# EAGLE design Circuit Diagram (EAGLE 9.3.0)
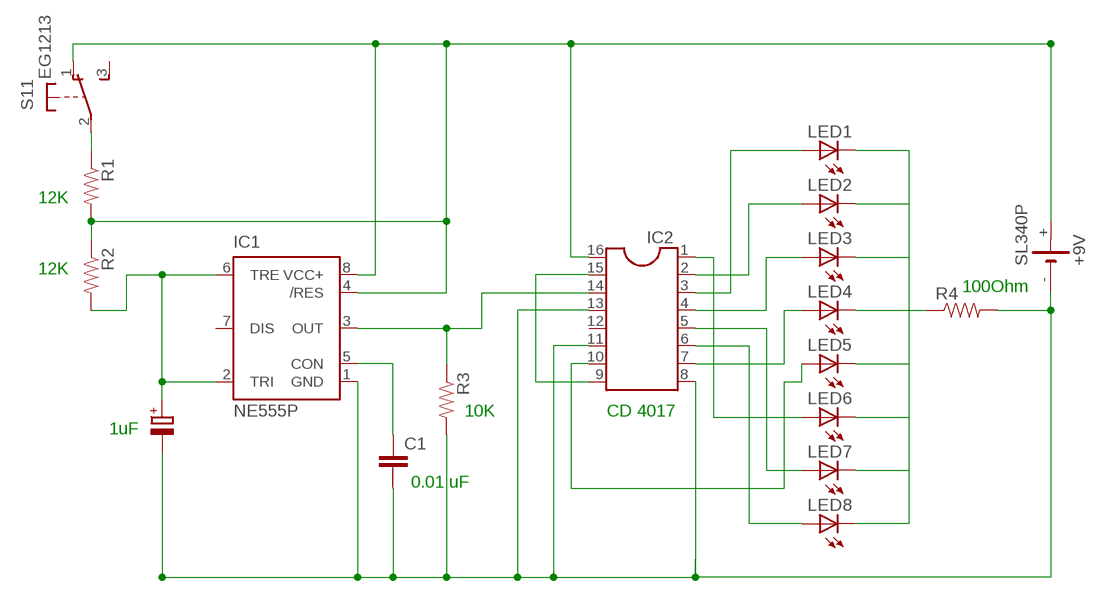
[diagram p0: schematic, sheet 1]

## Parts
+9V  SL340P  [SL-340/P3.6V]
C1  C2.5/6  [C2.5-6]
IC1  NE555P  [DIL-08]
IC2  DIL16  [DIL16]
LED1  LEDB156  [Q62902-B156]
LED2  LEDB156  [Q62902-B156]
LED3  LEDB156  [Q62902-B156]
LED4  LEDB156  [Q62902-B156]
LED5  LEDB156  [Q62902-B156]
LED6  LEDB156  [Q62902-B156]
LED7  LEDB156  [Q62902-B156]
LED8  LEDB156  [Q62902-B156]
R1  RESISTORAXIAL-0.3  [AXIAL-0.3]
R2  RESISTORAXIAL-0.3  [AXIAL-0.3]
R3  RESISTORAXIAL-0.3  [AXIAL-0.3]
R4  RESISTORAXIAL-0.3  [AXIAL-0.3]
S1  EG1213  [EG1213]

## Nets
N$1: IC2.3 LED1.A
N$2: IC2.2 LED2.A
N$3: IC2.4 LED3.A
N$4: IC2.7 LED4.A
N$5: IC2.10 LED5.A
N$6: IC2.1 LED6.A
N$7: IC2.5 LED7.A
N$8: IC2.9 IC2.15
N$9: +9V.- C1.2 IC1.1(GND) IC2.8 IC2.11 IC2.13 R3.P$2 R4.P$2
N$10: IC2.6 LED8.A
N$11: R1.P$1 S1.2(1:P)
N$13: LED1.K(C) LED2.K(C) LED3.K(C) LED4.K(C) LED5.K(C) LED6.K(C) LED7.K(C) LED8.K(C) R4.P$1
N$14: IC1.3(OUT) IC2.14 R3.P$1
N$18: +9V.+ IC1.4(/RES) IC1.8(VCC+) IC2.16 R1.P$2 R2.P$1 S1.1(1:O)
N$19: IC1.2(TRI) IC1.6(TRE) R2.P$2
N$21: C1.1 IC1.5(CON)
Unconnected: IC1.7(DIS) IC2.12 S1.3(1:S) S1.MT1(MT) S1.MT2(MT)

## Notes on the sheet
- 12K
- 12K
- 100Ohm
- 10K | CD 4017
- 1uF
- 0.01 uF

## Library data of the parts
+9V = battery:SL340P: LI BATTERY Sonnenschein SL-340 P 3.6 V
C1 = capacitor-wima:C: CAPACITOR naming: grid - package width
IC1 = SparkFun-AnalogIC:NE555: General purpose bipolar Timer; MF: Arrow Electronics; MPN: NE555N; OC_FARNELL: 1467742; OC_NEWARK: 89K1486
IC2 = ic-package:DIL16: Dual In Line / Socket
LED1-LED8 = led:LED: LED OSRAM: - CHIPLED LG R971, LG N971, LY N971, LG Q971, LY Q971, LO R971, LY R971 LH N974, LH R974 LS Q976, LO Q976, LY Q976 LO Q996 - Hyper CHIPLED LW Q18S LB Q993, LB Q99A, LB R99A - SideLED LS A670, LO A670, LY A670, LG A670, LP A670 LB A673, LV A673, LT A673, LW A673 LH A674 LY A675 LS A676, LA A676, LO A676, LY A676, LW A676 LS A679, LY A679, LG A679 - Hyper Micro SIDELED® LS Y876, LA Y876, LO Y876, LY Y876 LT Y87S - SmartLED LW L88C, LW L88S LB L89C, LB L89S, LG L890 LS L89K, LO L89K, LY L89K LS L896, LA L896, LO L896, LY L896 - TOPLED LS T670, LO T670, LY T670, LG T670, LP T670 LSG T670, LSP T670, LSY T670, LOP T670, LYG T670 LG T671, LOG T671, LSG T671 LB T673, LV T673, LT T673, LW T673 LH T674 LS T676, LA T676, LO T676, LY T676, LB T676, LH T676, LSB T676, LW T676 LB T67C, LV T67C, LT T67C, LS T67K, LO T67K, LY T67K, LW E67C LS E67B, LA E67B, LO E67B, LY E67B, LB E67C, LV E67C, LT E67C LW T67C LS T679, LY T679, LG T679 LS T770, LO T770, LY T770, LG T770, LP T770 LB T773, LV T773, LT T773, LW T773 LH T774 LS E675, LA E675, LY E675, LS T675 LS T776, LA T776, LO T776, LY T776, LB T776 LHGB T686 LT T68C, LB T68C - Hyper Mini TOPLED® LB M676 - Mini TOPLED Santana® LG M470 LS M47K, LO M47K, LY M47K Source: http://www.osram.convergy.de LUXEON: - LUMILED® LXK2-PW12-R00, LXK2-PW12-S00, LXK2-PW14-U00, LXK2-PW14-V00 LXK2-PM12-R00, LXK2-PM12-S00, LXK2-PM14-U00 LXK2-PE12-Q00, LXK2-PE12-R00, LXK2-PE12-S00, LXK2-PE14-T00, LXK2-PE14-U00 LXK2-PB12-K00, LXK2-PB12-L00, LXK2-PB12-M00, LXK2-PB14-N00, LXK2-PB14-P00, LXK2-PB14-Q00 LXK2-PR12-L00, LXK2-PR12-M00, LXK2-PR14-Q00, LXK2-PR14-R00 LXK2-PD12-Q00, LXK2-PD12-R00, LXK2-PD12-S00 LXK2-PH12-R00, LXK2-PH12-S00 LXK2-PL12-P00, LXK2-PL12-Q00, LXK2-PL12-R00 Source: www.luxeon.com KINGBRIGHT: KA-3528ASYC Source: www.kingbright.com
R1-R4 = SparkFun-Passives:RESISTOR: Resistor Basic schematic elements and footprints for 0603, 1206, and PTH resistors.
S1 = adafruit:EG1213: E-Switch right-angle slide SPDT Part #EG1213 http://www.ladyada.net/library/eagle

## Board
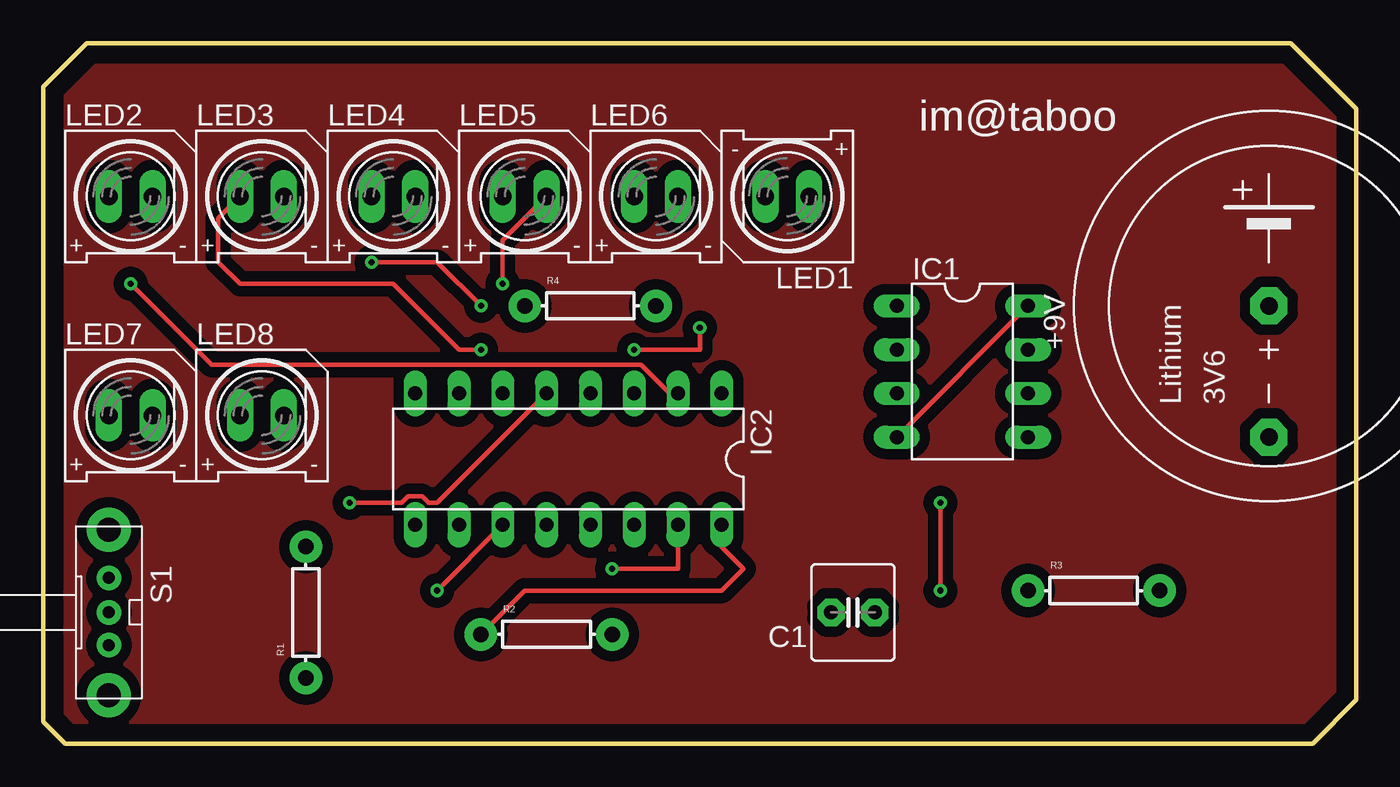
[diagram p1: board, top side]
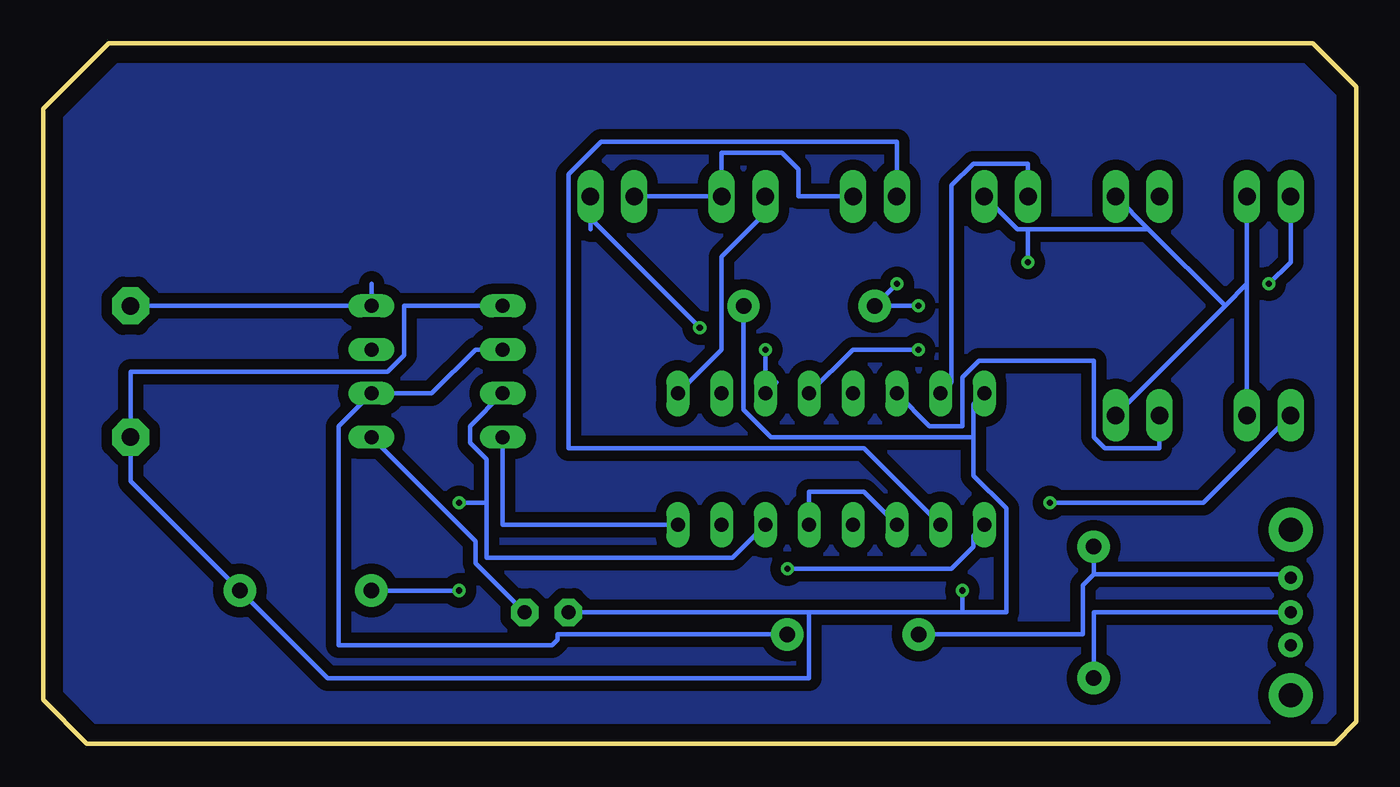
[diagram p2: board, bottom side, seen from below]

Size 76.2 x 40.64 mm. Coordinates in mm from the lower left corner, seen from the top.
Outline: 0,38.1 0,1.27 1.27,0 73.66,0 76.2,2.54 76.2,36.83 72.39,40.64 2.54,40.64 0,38.1
Copper layers (1*16): Top 0.035mm / dielectric 1.5mm / Bottom 0.035mm
Design rules "default *": minimum track width 10mil, minimum drill 0.35mm, track to track 10mil, track to pad 8mil, pad to pad 8mil, via to via 6mil, smd to smd 6mil, copper to edge 40mil, drill to drill 6mil, minimum pad ring 10mil, minimum via ring 8mil, stop-mask expansion 4mil, vias tented up to drill 0mil, thermal gap 10mil

### Footprints (pad centres in the part's own frame; a part is rotated, then mirrored left to right if it is on the bottom)
SL-340/P3.6V = drill 1.016 pad 2.159 octagon: + 0,0; - -7.62,0
C2.5-6 = drill 0.813 pad 1.6 octagon: 1 -1.27,0; 2 1.27,0
DIL-08 = drill 0.813 long: 1 -3.81,-3.81; 2 -1.27,-3.81; 3 1.27,-3.81; 4 3.81,-3.81; 5 3.81,3.81; 6 1.27,3.81; 7 -1.27,3.81; 8 -3.81,3.81
DIL16 = drill 0.813 long: 1 -8.89,-3.81; 2 -6.35,-3.81; 3 -3.81,-3.81; 4 -1.27,-3.81; 5 1.27,-3.81; 6 3.81,-3.81; 7 6.35,-3.81; 8 8.89,-3.81; 9 8.89,3.81; 10 6.35,3.81; 11 3.81,3.81; 12 1.27,3.81; 13 -1.27,3.81; 14 -3.81,3.81; 15 -6.35,3.81; 16 -8.89,3.81
Q62902-B156 = drill 1.016 long: A -1.27,0; K 1.27,0
AXIAL-0.3 = drill 0.9 pad 1.88: P$1 -3.81,0; P$2 3.81,0
EG1213 = drill 0.7 pad 1.422: 1 -2,0; 2 0,0; 3 1.9,0 | drill 1.4 pad 2.54: MT1 -4.8,0; MT2 4.8,0

### Placement (x,y rotation side)
+9V  71.12,25.4 90 top
C1  46.99,7.62 180 top
IC1  53.34,21.59 270 top
IC2  30.48,16.51 180 top
LED1  43.18,31.75 180 top
LED2  5.08,31.75 0 top
LED3  12.7,31.75 0 top
LED4  20.32,31.75 0 top
LED5  27.94,31.75 0 top
LED6  35.56,31.75 0 top
LED7  5.08,19.05 0 top
LED8  12.7,19.05 0 top
R1  15.24,7.62 90 top
R2  29.21,6.35 0 top
R3  60.96,8.89 0 top
R4  31.75,25.4 0 top
S1  3.81,7.62 270 top

### Tracks (layer width: path | path; a pad name or v marks a point on that pad's centre or on a via)
GND
  pour Bottom (isolate 0.61): 2.54,40.64 0,38.1 0,1.27 1.27,0 73.66,0 76.2,2.54 76.2,36.83 72.39,40.64
  pour Top (isolate 0.61): 2.54,39.37 1.27,38.1 1.27,1.27 73.66,1.27 74.93,2.54 74.93,3.81 74.93,35.56 74.93,36.83 72.39,39.37
N$1  (via drill 0.35)
  Top 0.254: v38.1,24.13 38.1,22.86 v34.29,22.86
  Bottom 0.254: 33.66,20.96 IC2.3 v34.29,22.86 | LED1.A 44.45,30.48 | 44.45,30.48 44.45,29.85 | 44.45,30.48 v38.1,24.13
N$2  (via drill 0.35)
  Top 0.254: IC2.2 36.35,20.32 34.7,21.97 9.78,21.97 v5.08,26.67
  Bottom 0.254: LED2.A 3.81,27.94 v5.08,26.67
N$3  (via drill 0.35)
  Top 0.254: v25.4,22.86 24.13,22.86 20.32,26.67 11.43,26.67 10.16,27.94 10.16,30.48 LED3.A
  Bottom 0.254: IC2.4 29.21,22.86 v25.4,22.86
  other vias: 11.43,31.75
N$4
  Bottom 0.254: IC2.7 23.5,20.96 23.5,32.38 22.22,33.65 19.05,33.65 LED4.A
N$5
  Bottom 0.254: IC2.10 28.57,17.15 45.72,17.15 45.72,33.02 43.82,34.93 26.67,34.93 LED5.A
N$6
  Bottom 0.254: IC2.1 36.83,22.86 36.83,28.26 34.29,30.8 LED6.A
N$7  (via drill 0.35)
  Top 0.254: IC2.5 22.86,13.97 22.38,13.97 22,14.35 21.18,14.35 20.8,13.97 v17.78,13.97
  Bottom 0.254: LED7.A 8.89,13.97 v17.78,13.97
N$8  (via drill 0.35)
  Top 0.254: v33.02,10.16 36.83,10.16 IC2.15
  Bottom 0.254: IC2.9 22.22,12.06 22.22,11.43 23.5,10.16 v33.02,10.16
N$9  (via drill 0.35)
  Top 0.254: IC2.11 v22.86,8.89
  Bottom 0.254: IC1.1 55.25,25.4 55.25,22.54 56.2,21.59 71.12,21.59 +9V.- 71.12,15.24 R3.P$2 59.69,3.81 31.75,3.81 31.75,7.62 | IC2.11 28.57,14.6 31.75,14.6 IC2.13 | IC2.8 22.22,19.69 22.22,17.78 | 22.22,17.78 22.22,15.56 20.32,13.65 20.32,7.62 22.86,7.62 | 22.86,7.62 31.75,7.62 | 31.75,7.62 C1.2 | R4.P$2 35.56,19.37 33.97,17.78 22.22,17.78 | v22.86,8.89 22.86,7.62
N$10
  Bottom 0.254: IC2.6 24.77,18.41 22.86,18.41 22.86,21.27 21.91,22.23 15.24,22.23 15.24,17.78 14.61,17.15 11.43,17.15 LED8.A
N$11
  Bottom 0.254: S1.2 15.24,7.62 R1.P$1
N$13  (via drill 0.35)
  Top 0.254: v25.4,25.4 22.86,27.94 v19.05,27.94 | v26.67,26.67 26.67,29.21 LED5.K
  Bottom 0.254: LED5.K 32.38,31.75 32.38,33.34 33.34,34.29 36.83,34.29 LED6.K LED1.K | LED2.K 6.35,26.67 | 6.35,26.67 LED7.K | 6.35,26.67 7.62,25.4 | 7.62,25.4 LED8.K | 7.62,25.4 12.06,29.85 | 12.06,29.85 LED3.K | LED4.K 19.68,29.85 19.05,29.85 | 12.06,29.85 19.05,29.85 | v25.4,25.4 R4.P$1 v26.67,26.67 | v19.05,27.94 19.05,29.85
N$14  (via drill 0.35)
  Top 0.254: v52.07,8.89 v52.07,13.97
  Bottom 0.254: IC2.14 36.2,10.8 50.48,10.8 50.48,13.97 | 50.48,13.97 50.48,16.51 51.44,17.46 51.44,18.41 IC1.3 | R3.P$1 v52.07,8.89 | v52.07,13.97 50.48,13.97
N$18
  Top 0.254: R2.P$1 27.94,8.89 39.37,8.89 40.64,10.16 39.37,11.43 IC2.16 | IC1.4 IC1.8
  Bottom 0.254: 15.24,9.84 3.81,9.84 S1.1 | R1.P$2 15.24,9.84 | R2.P$1 15.88,6.35 15.88,9.21 15.24,9.84 | IC2.16 49.53,12.7 IC1.4 | +9V.+ IC1.8 57.15,26.67
N$19
  Bottom 0.254: IC1.2 51.12,22.86 53.66,20.32 IC1.6 59.05,18.41 59.05,5.72 46.67,5.72 46.36,6.03 46.36,6.35 R2.P$2
N$21
  Bottom 0.254: IC1.5 51.12,11.75 51.12,10.48 C1.1

### Text on the board
tPlace: im@taboo | im@taboo